# EasyEDA Pro project ProProject_运放实验_2024-09-24.epro, schematic Schematic_all
Create Date: 2023-09-07; Page Name: P1; Project Name: 运放实验; Schematic Name: Schematic_all; Update Date: 2023-09-07; Company: 嘉立创EDA; Page Size: A4; Version: V1.0
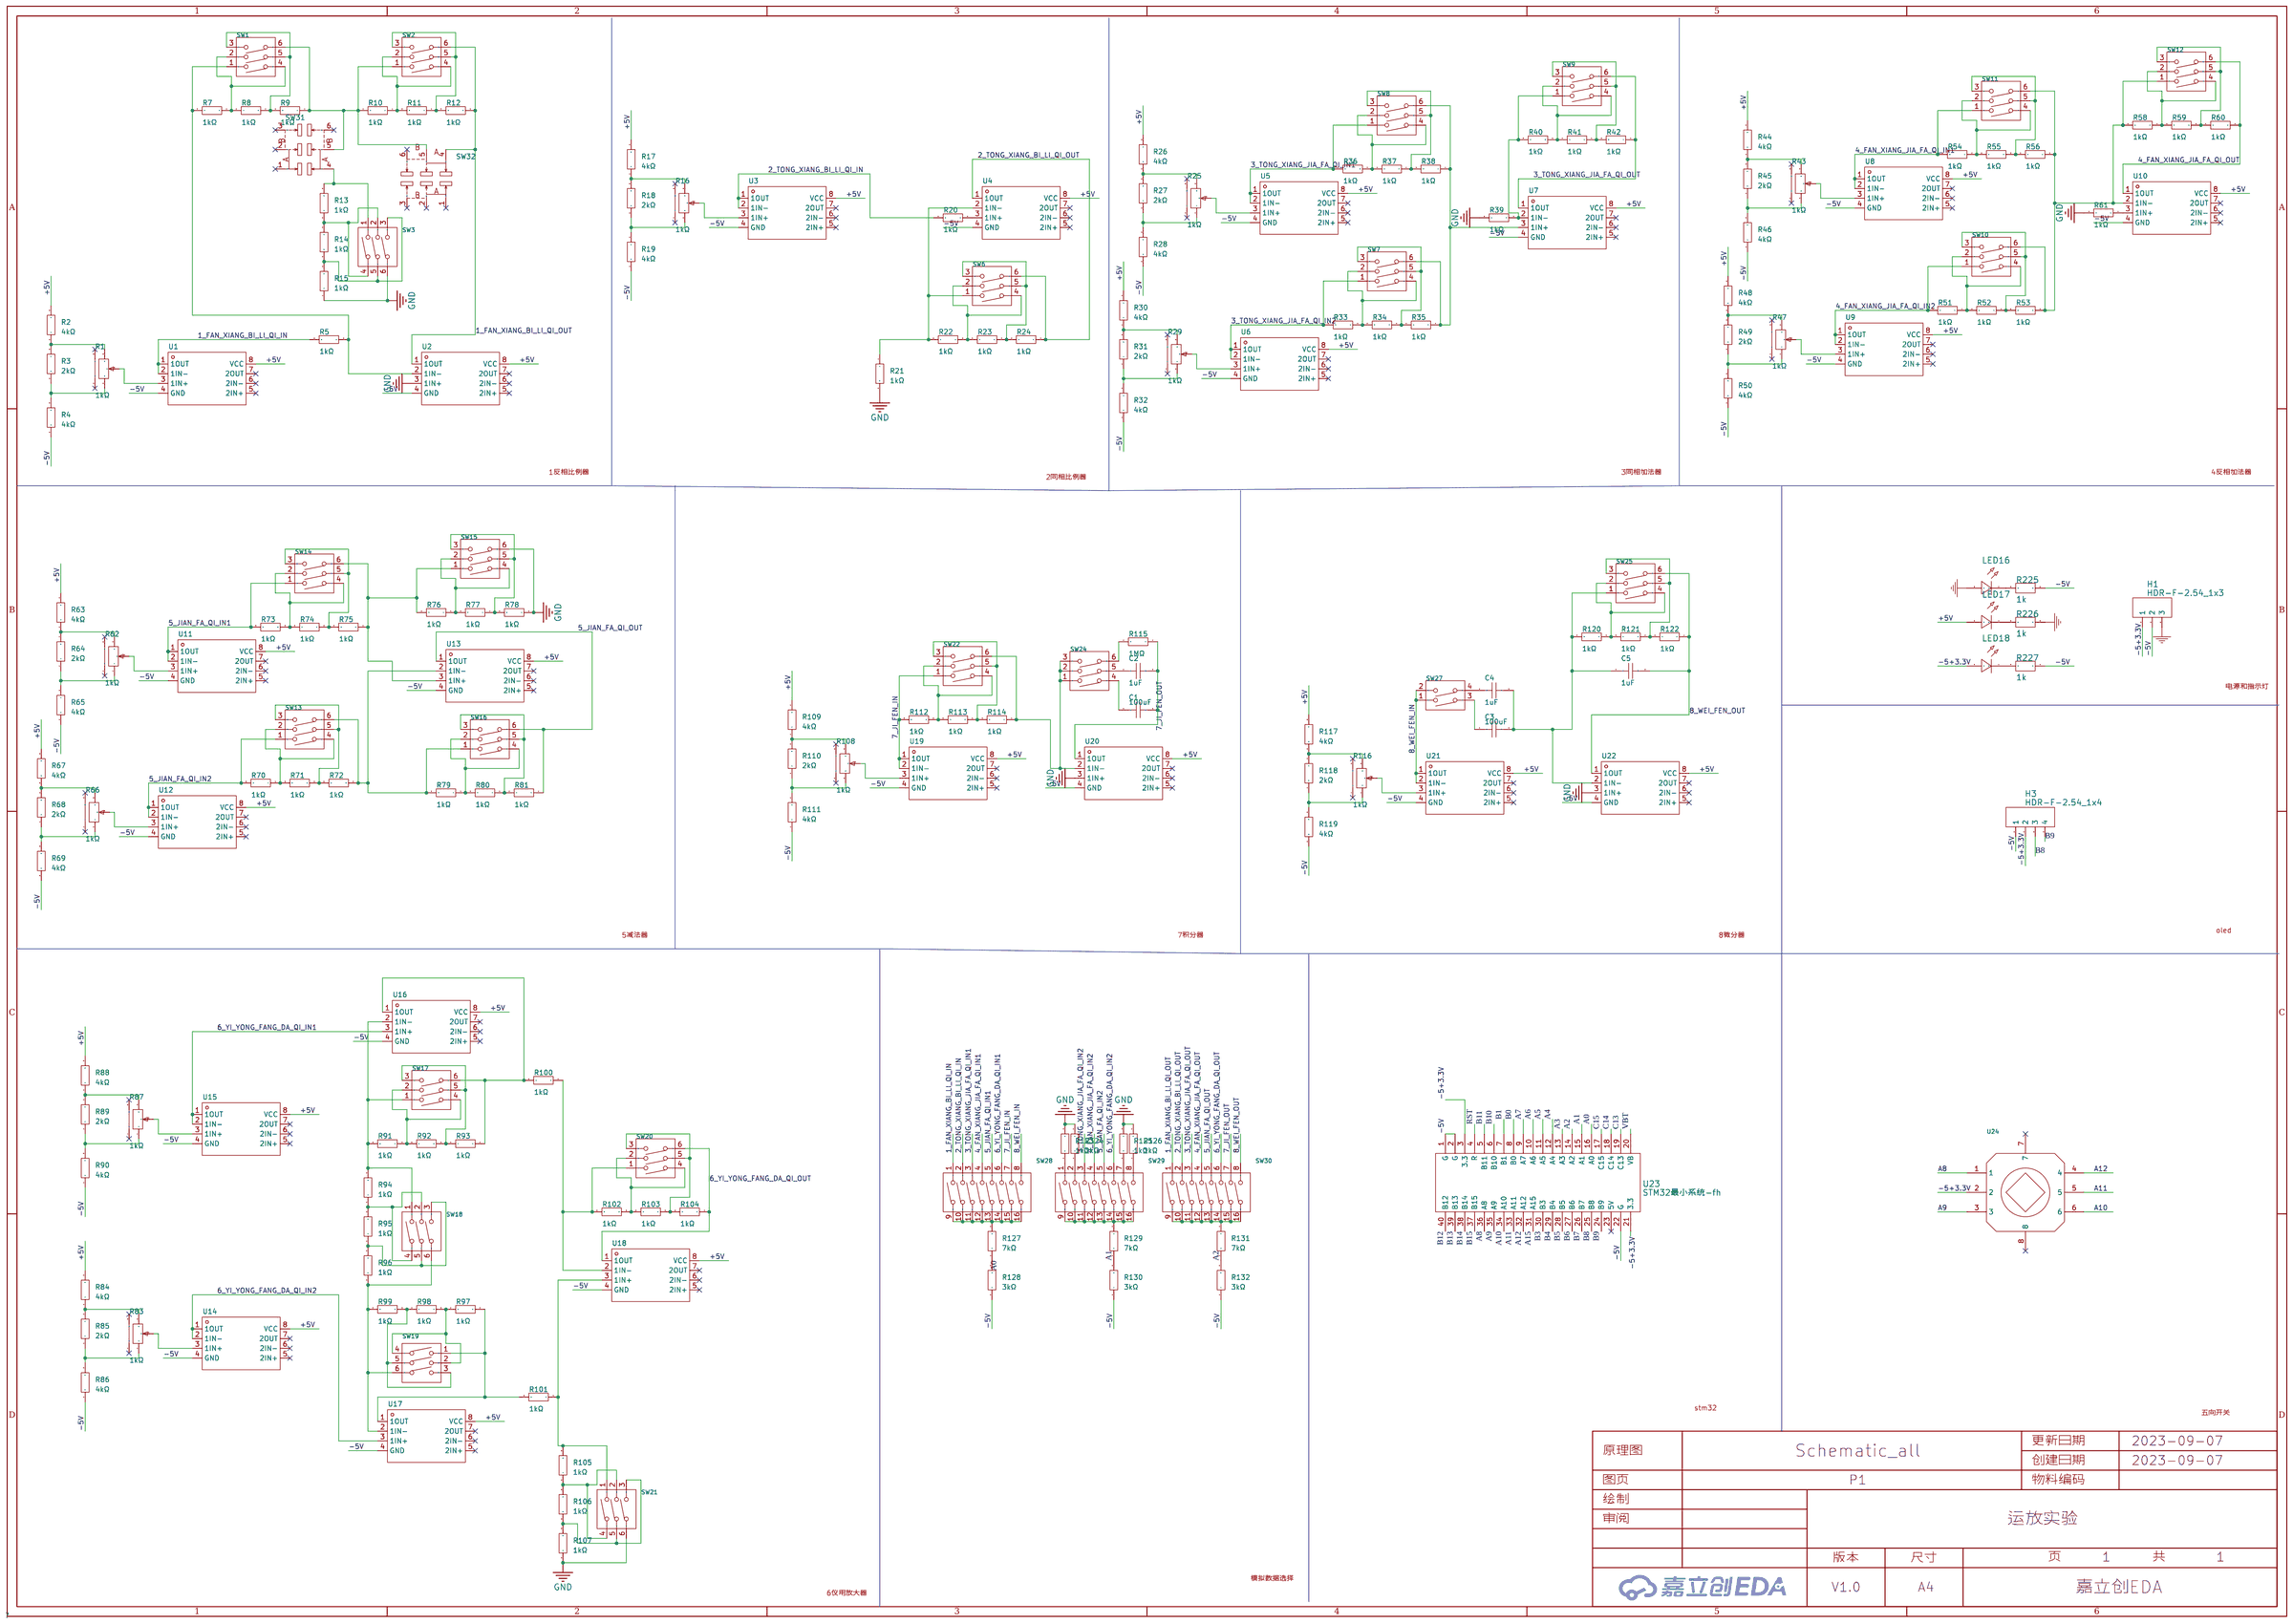
[diagram p4: schematic sheet]

## Parts
C1  100uF  [C0603]
C2  1uF  [C0603]
C3  100uF  [C0603]
C4  1uF  [C0603]
C5  1uF  [C0603]
H1  HDR-F-2.54_1x3  [HDR-F-2.54_1X3]
H3  HDR-F-2.54_1x4  [HDR-F-2.54_1X4]
LED16  -  [LED_0805]
LED17  -  [LED_0805]
LED18  -  [LED_0805]
R1  1kΩ  [RES-ADJ-TH_RK09K1130AJ3]
R2  4kΩ  [R0603]
R3  2kΩ  [R0603]
R4  4kΩ  [R0603]
R5  1kΩ  [R0603]
R7  1kΩ  [R0603]
R8  1kΩ  [R0603]
R9  1kΩ  [R0603]
R10  1kΩ  [R0603]
R11  1kΩ  [R0603]
R12  1kΩ  [R0603]
R13  1kΩ  [R0603]
R14  1kΩ  [R0603]
R15  1kΩ  [R0603]
R16  1kΩ  [RES-ADJ-TH_RK09K1130AJ3]
R17  4kΩ  [R0603]
R18  2kΩ  [R0603]
R19  4kΩ  [R0603]
R20  1kΩ  [R0603]
R21  1kΩ  [R0603]
R22  1kΩ  [R0603]
R23  1kΩ  [R0603]
R24  1kΩ  [R0603]
R25  1kΩ  [RES-ADJ-TH_RK09K1130AJ3]
R26  4kΩ  [R0603]
R27  2kΩ  [R0603]
R28  4kΩ  [R0603]
R29  1kΩ  [RES-ADJ-TH_RK09K1130AJ3]
R30  4kΩ  [R0603]
R31  2kΩ  [R0603]
R32  4kΩ  [R0603]
R33  1kΩ  [R0603]
R34  1kΩ  [R0603]
R35  1kΩ  [R0603]
R36  1kΩ  [R0603]
R37  1kΩ  [R0603]
R38  1kΩ  [R0603]
R39  1kΩ  [R0603]
R40  1kΩ  [R0603]
R41  1kΩ  [R0603]
R42  1kΩ  [R0603]
R43  1kΩ  [RES-ADJ-TH_RK09K1130AJ3]
R44  4kΩ  [R0603]
R45  2kΩ  [R0603]
R46  4kΩ  [R0603]
R47  1kΩ  [RES-ADJ-TH_RK09K1130AJ3]
R48  4kΩ  [R0603]
R49  2kΩ  [R0603]
R50  4kΩ  [R0603]
R51  1kΩ  [R0603]
R52  1kΩ  [R0603]
R53  1kΩ  [R0603]
R54  1kΩ  [R0603]
R55  1kΩ  [R0603]
R56  1kΩ  [R0603]
R58  1kΩ  [R0603]
R59  1kΩ  [R0603]
R60  1kΩ  [R0603]
R61  1kΩ  [R0603]
R62  1kΩ  [RES-ADJ-TH_RK09K1130AJ3]
R63  4kΩ  [R0603]
R64  2kΩ  [R0603]
R65  4kΩ  [R0603]
R66  1kΩ  [RES-ADJ-TH_RK09K1130AJ3]
R67  4kΩ  [R0603]
R68  2kΩ  [R0603]
R69  4kΩ  [R0603]
R70  1kΩ  [R0603]
R71  1kΩ  [R0603]
R72  1kΩ  [R0603]
R73  1kΩ  [R0603]
R74  1kΩ  [R0603]
R75  1kΩ  [R0603]
R76  1kΩ  [R0603]
R77  1kΩ  [R0603]
R78  1kΩ  [R0603]
R79  1kΩ  [R0603]
R80  1kΩ  [R0603]
R81  1kΩ  [R0603]
R83  1kΩ  [RES-ADJ-TH_RK09K1130AJ3]
R84  4kΩ  [R0603]
R85  2kΩ  [R0603]
R86  4kΩ  [R0603]
R87  1kΩ  [RES-ADJ-TH_RK09K1130AJ3]
R88  4kΩ  [R0603]
R89  2kΩ  [R0603]
R90  4kΩ  [R0603]
R91  1kΩ  [R0603]
R92  1kΩ  [R0603]
R93  1kΩ  [R0603]
R94  1kΩ  [R0603]
R95  1kΩ  [R0603]
R96  1kΩ  [R0603]
R97  1kΩ  [R0603]
R98  1kΩ  [R0603]
R99  1kΩ  [R0603]
R100  1kΩ  [R0603]
R101  1kΩ  [R0603]
R102  1kΩ  [R0603]
R103  1kΩ  [R0603]
R104  1kΩ  [R0603]
R105  1kΩ  [R0603]
R106  1kΩ  [R0603]
R107  1kΩ  [R0603]
R108  1kΩ  [RES-ADJ-TH_RK09K1130AJ3]
R109  4kΩ  [R0603]
R110  2kΩ  [R0603]
R111  4kΩ  [R0603]
R112  1kΩ  [R0603]
R113  1kΩ  [R0603]
R114  1kΩ  [R0603]
R115  1MΩ  [R0603]
R116  1kΩ  [RES-ADJ-TH_RK09K1130AJ3]
R117  4kΩ  [R0603]
R118  2kΩ  [R0603]
R119  4kΩ  [R0603]
R120  1kΩ  [R0603]
R121  1kΩ  [R0603]
R122  1kΩ  [R0603]
R123  1kΩ  [R0603]
R124  1kΩ  [R0603]
R125  1kΩ  [R0603]
R126  1kΩ  [R0603]
R127  7kΩ  [R0603]
R128  3kΩ  [R0603]
R129  7kΩ  [R0603]
R130  3kΩ  [R0603]
R131  7kΩ  [R0603]
R132  3kΩ  [R0603]
R225  1k  [R0805]
R226  1k  [R0805]
R227  1k  [R0805]
SW1  DSWB03LHGET  [SW-TH_DSWB03LHGET]
SW2  DSWB03LHGET  [SW-TH_DSWB03LHGET]
SW3  DSWB03LHGET  [SW-TH_DSWB03LHGET]
SW6  DSWB03LHGET  [SW-TH_DSWB03LHGET]
SW7  DSWB03LHGET  [SW-TH_DSWB03LHGET]
SW8  DSWB03LHGET  [SW-TH_DSWB03LHGET]
SW9  DSWB03LHGET  [SW-TH_DSWB03LHGET]
SW10  DSWB03LHGET  [SW-TH_DSWB03LHGET]
SW11  DSWB03LHGET  [SW-TH_DSWB03LHGET]
SW12  DSWB03LHGET  [SW-TH_DSWB03LHGET]
SW13  DSWB03LHGET  [SW-TH_DSWB03LHGET]
SW14  DSWB03LHGET  [SW-TH_DSWB03LHGET]
SW15  DSWB03LHGET  [SW-TH_DSWB03LHGET]
SW16  DSWB03LHGET  [SW-TH_DSWB03LHGET]
SW17  DSWB03LHGET  [SW-TH_DSWB03LHGET]
SW18  DSWB03LHGET  [SW-TH_DSWB03LHGET]
SW19  DSWB03LHGET  [SW-TH_DSWB03LHGET]
SW20  DSWB03LHGET  [SW-TH_DSWB03LHGET]
SW21  DSWB03LHGET  [SW-TH_DSWB03LHGET]
SW22  DSWB03LHGET  [SW-TH_DSWB03LHGET]
SW24  DSWB03LHGET  [SW-TH_DSWB03LHGET]
SW25  DSWB03LHGET  [SW-TH_DSWB03LHGET]
SW27  DSWB02LHGET  [SW-TH_DSWB02LHGET]
SW28  DSWB08LHGET  [SW-TH_DSWB08LHGET]
SW29  DSWB08LHGET  [SW-TH_DSWB08LHGET]
SW30  DSWB08LHGET  [SW-TH_DSWB08LHGET]
SW31  MST22D18G2  [SW-SMD_MST22D18G2]
SW32  MST22D18G2  [SW-SMD_MST22D18G2]
U1  LM393DR  [SOIC-8_L5.0-W4.0-P1.27-LS6.0-BL]
U2  LM393DR  [SOIC-8_L5.0-W4.0-P1.27-LS6.0-BL]
U3  LM393DR  [SOIC-8_L5.0-W4.0-P1.27-LS6.0-BL]
U4  LM393DR  [SOIC-8_L5.0-W4.0-P1.27-LS6.0-BL]
U5  LM393DR  [SOIC-8_L5.0-W4.0-P1.27-LS6.0-BL]
U6  LM393DR  [SOIC-8_L5.0-W4.0-P1.27-LS6.0-BL]
U7  LM393DR  [SOIC-8_L5.0-W4.0-P1.27-LS6.0-BL]
U8  LM393DR  [SOIC-8_L5.0-W4.0-P1.27-LS6.0-BL]
U9  LM393DR  [SOIC-8_L5.0-W4.0-P1.27-LS6.0-BL]
U10  LM393DR  [SOIC-8_L5.0-W4.0-P1.27-LS6.0-BL]
U11  LM393DR  [SOIC-8_L5.0-W4.0-P1.27-LS6.0-BL]
U12  LM393DR  [SOIC-8_L5.0-W4.0-P1.27-LS6.0-BL]
U13  LM393DR  [SOIC-8_L5.0-W4.0-P1.27-LS6.0-BL]
U14  LM393DR  [SOIC-8_L5.0-W4.0-P1.27-LS6.0-BL]
U15  LM393DR  [SOIC-8_L5.0-W4.0-P1.27-LS6.0-BL]
U16  LM393DR  [SOIC-8_L5.0-W4.0-P1.27-LS6.0-BL]
U17  LM393DR  [SOIC-8_L5.0-W4.0-P1.27-LS6.0-BL]
U18  LM393DR  [SOIC-8_L5.0-W4.0-P1.27-LS6.0-BL]
U19  LM393DR  [SOIC-8_L5.0-W4.0-P1.27-LS6.0-BL]
U20  LM393DR  [SOIC-8_L5.0-W4.0-P1.27-LS6.0-BL]
U21  LM393DR  [SOIC-8_L5.0-W4.0-P1.27-LS6.0-BL]
U22  LM393DR  [SOIC-8_L5.0-W4.0-P1.27-LS6.0-BL]
U23  STM32最小系统-fh  [STM32最小系统板]
U24  GT-TCA06F-H050-L1  [KEY-SMD_GT-TCA06F-H050-L1]

## Library data of the parts
C1-C5 = CAP_0603: Supplier Footprint: 0603
H1 = HDR-F-2.54_1x3: Supplier Part: C146690; Supplier: LCSC
H3 = HDR-F-2.54_1x4: Supplier Part: C225501; Supplier: LCSC
LED16-LED18 = LED_0805-R: Supplier Footprint: 0805
R1 R16 R25 R29 R43 R47 R62 R66 R83 R87 R108 R116 = RK09K1130AJ3: 阻值:10kΩ;精度:±20%;功率:50mW;; LCSC Part Name: 10kΩ ±20%; Supplier Part: C388854; Manufacturer: ALPSALPINE(阿尔卑斯阿尔派); Supplier Footprint: 插件; JLCPCB Part Class: 扩展库; Datasheet: https://atta.szlcsc.com/upload/public/pdf/source/20190429/C388854_7CB4260EB45E5FBD5A81223BC5101220.pdf; Supplier: LCSC; Tolerance: ±20%; Power(Watts): 50mW; Rated Voltage: 20V
R2-R5 R7-R15 R17-R24 R26-R28 R30-R42 R44-R46 R48-R56 R58-R61 R63-R65 R67-R81 R84-R86 R88-R107 R109-R115 R117-R132 = 0603WAF1002T5E: 电阻类型:厚膜电阻;阻值:10kΩ;精度:±1%;功率:100mW;; LCSC Part Name: 厚膜电阻 10kΩ ±1% 100mW; Supplier Part: C25804; Manufacturer: UNI-ROYAL(厚声); Supplier Footprint: 0603; JLCPCB Part Class: 基础库; Datasheet: https://atta.szlcsc.com/upload/public/pdf/source/20200306/C422600_1E6D84923E4A46A82E41ADD87F860B5C.pdf; Supplier: LCSC; Type: 厚膜电阻; Tolerance: ±1%; Power(Watts): 100mW; Temperature Coefficient: ±100ppm/℃; Overload Voltage (Max): 75V; Operating Temperature Range: -55℃~+155℃
R225-R227 = 1k
SW1-SW3 SW6-SW22 SW24 SW25 = DSWB03LHGET: 类型:平拨,凸起式;电路结构:单刀单掷;开关位数:3;使用寿命:-;颜色:红色;; LCSC Part Name: 间距1.27mm 平拨,凸起式 3位拨码开关; Supplier Part: C99420; Manufacturer: YE; Supplier Footprint: 插件; JLCPCB Part Class: 扩展库; Datasheet: https://atta.szlcsc.com/upload/public/pdf/source/20170330/1490854274194.pdf; Supplier: LCSC; Type: 平拨,凸起式; Circuit: 单刀单掷; Number of Positions: 3; Lead Pitch: 2.54mm; Color: 红色
SW27 = DSWB02LHGET: 类型:平拨,凸起式;电路结构:单刀单掷;开关位数:2;使用寿命:-;颜色:红色;; LCSC Part Name: 拨码开关,平拨开关,DSWB02LHGET; Supplier Part: C99421; Manufacturer: YE; Supplier Footprint: 插件; JLCPCB Part Class: 扩展库; Datasheet: https://atta.szlcsc.com/upload/public/pdf/source/20170330/1490854270511.pdf; Supplier: LCSC; Type: 平拨,凸起式; Circuit: 单刀单掷; Number of Positions: 2; Lead Pitch: 2.54mm; Color: 红色
SW28-SW30 = DSWB08LHGET: 类型:平拨,凸起式;电路结构:单刀单掷;开关位数:8;使用寿命:-;颜色:红色;; LCSC Part Name: 间距2.54mm 平拨,凸起式  8位拨码开关; Supplier Part: C99413; Manufacturer: YE; Supplier Footprint: 插件; JLCPCB Part Class: 扩展库; Datasheet: https://atta.szlcsc.com/upload/public/pdf/source/20170330/1490854214069.pdf; Supplier: LCSC; Type: 平拨,凸起式; Circuit: 单刀单掷; Number of Positions: 8; Lead Pitch: 2.54mm; Color: 红色
SW31 SW32 = MST22D18G2: 额定电流(DC)：50mA 额定电压(DC)：12V 电路结构：单刀双掷 安装方式：立贴 机械寿命：10000 滑钮形状：矩形柱状 引脚样式：SMD接片 工作温度：-30℃~+80℃ 开关长度：9.1mm 开关宽度：3.6mm 开关高度：3.45mm 柄高：2mm; LCSC Part Name: 两档立式贴片 6脚拨动 柄长2.0MM; Supplier Part: C431544; Manufacturer: SHOU HAN(首韩); Supplier Footprint: SMD,3.6x9.1mm; JLCPCB Part Class: 扩展库; Datasheet: https://atta.szlcsc.com/upload/public/pdf/source/20190925/C431544_D32DFFD935A96A6C5145903882D4ABA1.pdf; Supplier: LCSC
U1-U22 = LM393DR: 比较器组数:2;电源电压:2V~36V,±1V~18V;各通道供电电流:2.5mA;输出类型:CMOS, MOS, Open-Collector, TTL;传播延迟:-;; Supplier Part: C67470; Manufacturer: TI(德州仪器); Supplier Footprint: SOIC-8-150mil; JLCPCB Part Class: 扩展库; Datasheet: https://atta.szlcsc.com/upload/public/pdf/source/20160127/1457707757853.pdf; Supplier: LCSC; Number of Elements: 2; Supply Voltage（Single）: 2V~36V,±1V~18V; Iq per channel (Typ): 2.5mA; Output Type: CMOS, MOS, Open-Collector, TTL; Operating Temperature: 0°C ~ 70°C
U23 = STM32最小系统-fh
U24 = GT-TCA06F-H050-L1: 机械寿命:-;; LCSC Part Name: 斜五向轻触开关 H5.0mm 400gf 带贴片脚; Supplier Part: C3019725; Manufacturer: G-Switch(品赞); Supplier Footprint: SMD; JLCPCB Part Class: Extended Part; Datasheet: https://atta.szlcsc.com/upload/public/pdf/source/20220627/F7A64F0F346B15FF80DEC5591ADA8118.pdf; Supplier: LCSC; Switch Length: 7.5mm; Switch Width: 7.5mm; Switch Height: 5mm

## Nets
+5V: LED17.2(A) R2.2 R17.2 R26.2 R30.2 R44.2 R48.2 R63.2 R67.2 R84.2 R88.2 R109.2 R117.2 U1.8(VCC) U2.8(VCC) U3.8(VCC) U4.8(VCC) U5.8(VCC) U6.8(VCC) U7.8(VCC) U8.8(VCC) U9.8(VCC) U10.8(VCC) U11.8(VCC) U12.8(VCC) U13.8(VCC) U14.8(VCC) U15.8(VCC) U16.8(VCC) U17.8(VCC) U18.8(VCC) U19.8(VCC) U20.8(VCC) U21.8(VCC) U22.8(VCC)
-5V: H1.2 H3.1 R4.1 R19.1 R28.1 R32.1 R46.1 R50.1 R65.1 R69.1 R86.1 R90.1 R111.1 R119.1 R128.1 R130.1 R132.1 R225.1 R227.1 U1.4(GND) U2.4(GND) U3.4(GND) U4.4(GND) U5.4(GND) U6.4(GND) U7.4(GND) U8.4(GND) U9.4(GND) U10.4(GND) U11.4(GND) U12.4(GND) U13.4(GND) U14.4(GND) U15.4(GND) U16.4(GND) U17.4(GND) U18.4(GND) U19.4(GND) U20.4(GND) U21.4(GND) U22.4(GND) U23.1(G) U23.2(G) U23.22(G)
GND: H1.3 LED16.2(A) R15.1 R21.2 R39.2 R61.2 R78.1 R107.1 R123.2 R124.2 R125.2 R126.2 R226.1 SW3.6 SW15.6 SW21.6 U2.3(1IN+) U20.3(1IN+) U22.3(1IN+)
1_FAN_XIANG_BI_LI_QI_IN: R5.2 SW28.1 U1.1(1OUT) U1.2(1IN-)
1_FAN_XIANG_BI_LI_QI_OUT: R12.1 SW2.6 SW30.1 SW32.4 U2.1(1OUT)
2_TONG_XIANG_BI_LI_QI_IN: R20.2 SW28.2 U3.1(1OUT) U3.2(1IN-)
2_TONG_XIANG_BI_LI_QI_OUT: R24.1 SW6.6 SW30.2 U4.1(1OUT)
3_TONG_XIANG_JIA_FA_QI_IN1: R36.2 SW8.1 SW28.3 U5.1(1OUT) U5.2(1IN-)
3_TONG_XIANG_JIA_FA_QI_IN2: R33.2 SW7.1 SW29.3 U6.1(1OUT) U6.2(1IN-)
3_TONG_XIANG_JIA_FA_QI_OUT: R42.1 SW9.6 SW30.3 U7.1(1OUT)
4_FAN_XIANG_JIA_FA_QI_IN1: R54.2 SW11.1 SW28.4 U8.1(1OUT) U8.2(1IN-)
4_FAN_XIANG_JIA_FA_QI_IN2: R51.2 SW10.1 SW29.4 U9.1(1OUT) U9.2(1IN-)
4_FAN_XIANG_JIA_FA_QI_OUT: R60.1 SW12.6 SW30.4 U10.1(1OUT)
5_JIAN_FA_QI_IN1: R73.2 SW14.1 SW28.5 U11.1(1OUT) U11.2(1IN-)
5_JIAN_FA_QI_IN2: R70.2 SW13.1 SW29.5 U12.1(1OUT) U12.2(1IN-)
5_JIAN_FA_QI_OUT: R81.1 SW16.6 SW30.5 U13.1(1OUT)
6_YI_YONG_FANG_DA_QI_IN1: SW28.6 U15.1(1OUT) U15.2(1IN-) U16.3(1IN+)
6_YI_YONG_FANG_DA_QI_IN2: SW29.6 U14.1(1OUT) U14.2(1IN-) U17.3(1IN+)
6_YI_YONG_FANG_DA_QI_OUT: R104.1 SW20.6 SW30.6 U18.1(1OUT)
7_JI_FEN_IN: R112.2 SW22.1 SW28.7 U19.1(1OUT) U19.2(1IN-)
7_JI_FEN_OUT: C1.2 C2.2 R115.1 SW30.7 U20.1(1OUT)
8_WEI_FEN_IN: SW27.1 SW27.2 SW28.8 U21.1(1OUT) U21.2(1IN-)
8_WEI_FEN_OUT: C5.2 R122.1 SW25.6 SW30.8 U22.1(1OUT)
-5+3.3V: H1.1 H3.2 LED18.2(A) U23.3(3.3) U23.21(3.3) U24.2
A0: R127.1 R128.2 U23.16(A0)
A1: R129.1 R130.2 U23.15(A1)
A2: R131.1 R132.2 U23.14(A2)
A3: U23.13(A3)
A4: U23.12(A4)
A5: U23.11(A5)
A6: U23.10(A6)
A7: U23.9(A7)
A8: U23.36(A8) U24.1
A9: U23.35(A9) U24.3
A10: U23.34(A10) U24.6
A11: U23.33(A11) U24.5
A12: U23.32(A12) U24.4
A15: U23.31(A15)
B0: U23.8(B0)
B1: U23.7(B1)
B3: U23.30(B3)
B4: U23.29(B4)
B5: U23.28(B5)
B6: U23.27(B6)
B7: U23.26(B7)
B8: H3.3 U23.25(B8)
B9: H3.4 U23.24(B9)
B10: U23.6(B10)
B11: U23.5(B11)
B12: U23.40(B12)
B13: U23.39(B13)
B14: U23.38(B14)
B15: U23.37(B15)
C13: U23.19(C13)
C14: U23.18(C14)
C15: U23.17(C15)
RST: U23.4(R)
VBT: U23.20(VB)
$1N5564: R62.3 R63.1 R64.2
$1N5567: R62.1 R64.1 R65.2
$1N5578: R62.2 U11.3(1IN+)
$1N5588: R66.3 R67.1 R68.2
$1N5591: R66.1 R68.1 R69.2
$1N5602: R66.2 U12.3(1IN+)
$1N5609: R70.1 R71.2 SW13.2 SW13.4
$1N5617: R71.1 R72.2 SW13.3 SW13.5
$1N5625: R73.1 R74.2 SW14.2 SW14.4
$1N5633: R74.1 R75.2 SW14.3 SW14.5
$1N5932: R76.1 R77.2 SW15.2 SW15.4
$1N5940: R77.1 R78.2 SW15.3 SW15.5
$1N5959: R75.1 R76.2 SW14.6 SW15.1 U13.3(1IN+)
$1N6163: R79.1 R80.2 SW16.2 SW16.4
$1N6171: R80.1 R81.2 SW16.3 SW16.5
$1N6191: R72.1 R79.2 SW13.6 SW16.1 U13.2(1IN-)
$1N6501: R83.3 R84.1 R85.2
$1N6504: R83.1 R85.1 R86.2
$1N6515: R83.2 U14.3(1IN+)
$1N6753: R87.3 R88.1 R89.2
$1N6756: R87.1 R89.1 R90.2
$1N6767: R87.2 U15.3(1IN+)
$1N7112: R91.1 R92.2 SW17.2 SW17.4
$1N7120: R92.1 R93.2 SW17.3 SW17.5
$1N7297: R94.1 R95.2 SW18.2 SW18.4
$1N7305: R95.1 R96.2 SW18.3 SW18.5
$1N7478: R97.1 R98.2 SW19.2 SW19.4
$1N7486: R98.1 R99.2 SW19.3 SW19.5
$1N7519: R91.2 R94.2 SW17.1 SW18.1 U16.2(1IN-)
$1N7528: R93.1 R100.2 SW17.6 U16.1(1OUT)
$1N7610: R96.1 R99.1 SW18.6 SW19.6 U17.2(1IN-)
$1N7723: R97.2 R101.2 SW19.1 U17.1(1OUT)
$1N7950: R102.1 R103.2 SW20.2 SW20.4
$1N7958: R103.1 R104.2 SW20.3 SW20.5
$1N8133: R105.1 R106.2 SW21.2 SW21.4
$1N8141: R106.1 R107.2 SW21.3 SW21.5
$1N8558: R101.1 R105.2 SW21.1 U18.3(1IN+)
$1N8570: R100.1 R102.2 SW20.1 U18.2(1IN-)
$1N8808: R108.3 R109.1 R110.2
$1N8811: R108.1 R110.1 R111.2
$1N8822: R108.2 U19.3(1IN+)
$1N9066: R112.1 R113.2 SW22.2 SW22.4
$1N9074: R113.1 R114.2 SW22.3 SW22.5
$1N9289: C1.1 SW24.4
$1N9422: C2.1 SW24.5
$1N9426: R114.1 SW22.6 SW24.1 SW24.2 SW24.3 U20.2(1IN-)
$1N9437: R115.2 SW24.6
$1N10669: R116.3 R117.1 R118.2
$1N10672: R116.1 R118.1 R119.2
$1N10683: R116.2 U21.3(1IN+)
$1N10903: R120.1 R121.2 SW25.2 SW25.4
$1N10911: R121.1 R122.2 SW25.3 SW25.5
$1N11058: C3.1 SW27.3
$1N11164: C4.1 SW27.4
$1N11228: C3.2 C4.2 C5.1 R120.2 SW25.1 U22.2(1IN-)
$1N11683: R123.1 SW29.1
$1N11722: R124.1 SW29.2
$1N11761: R125.1 SW29.7
$1N11800: R126.1 SW29.8
$1N16821: R127.2 SW28.9 SW28.10 SW28.11 SW28.12 SW28.13 SW28.14 SW28.15 SW28.16
$1N16840: R129.2 SW29.9 SW29.10 SW29.11 SW29.12 SW29.13 SW29.14 SW29.15 SW29.16
$1N16862: R131.2 SW30.9 SW30.10 SW30.11 SW30.12 SW30.13 SW30.14 SW30.15 SW30.16
$1N26687: LED16.1(C) R225.2
$1N26764: LED17.1(C) R226.2
$1N26843: LED18.1(C) R227.2
Net-(R1-1): R1.1 R3.1 R4.2
Net-(R1-2): R1.2 U1.3(1IN+)
Net-(R1-3): R1.3 R2.1 R3.2
Net-(R5-1): R5.1 R7.2 SW1.1 U2.2(1IN-)
Net-(R7-1): R7.1 R8.2 SW1.2 SW1.4
Net-(R8-1): R8.1 R9.2 SW1.3 SW1.5
Net-(R9-1): R9.1 R10.2 SW1.6 SW2.1 SW31.5 SW32.5
Net-(R10-1): R10.1 R11.2 SW2.2 SW2.4
Net-(R11-1): R11.1 R12.2 SW2.3 SW2.5
Net-(R13-1): R13.1 R14.2 SW3.2 SW3.4
Net-(R13-2): R13.2 SW3.1 SW31.4
Net-(R14-1): R14.1 R15.2 SW3.3 SW3.5
Net-(R16-1): R16.1 R18.1 R19.2
Net-(R16-2): R16.2 U3.3(1IN+)
Net-(R16-3): R16.3 R17.1 R18.2
Net-(R20-1): R20.1 U4.3(1IN+)
Net-(R21-1): R21.1 R22.2 SW6.1 U4.2(1IN-)
Net-(R22-1): R22.1 R23.2 SW6.2 SW6.4
Net-(R23-1): R23.1 R24.2 SW6.3 SW6.5
Net-(R25-1): R25.1 R27.1 R28.2
Net-(R25-2): R25.2 U5.3(1IN+)
Net-(R25-3): R25.3 R26.1 R27.2
Net-(R29-1): R29.1 R31.1 R32.2
Net-(R29-2): R29.2 U6.3(1IN+)
Net-(R29-3): R29.3 R30.1 R31.2
Net-(R33-1): R33.1 R34.2 SW7.2 SW7.4
Net-(R34-1): R34.1 R35.2 SW7.3 SW7.5
Net-(R35-1): R35.1 R38.1 SW7.6 SW8.6 U7.3(1IN+)
Net-(R36-1): R36.1 R37.2 SW8.2 SW8.4
Net-(R37-1): R37.1 R38.2 SW8.3 SW8.5
Net-(R39-1): R39.1 R40.2 SW9.1 U7.2(1IN-)
Net-(R40-1): R40.1 R41.2 SW9.2 SW9.4
Net-(R41-1): R41.1 R42.2 SW9.3 SW9.5
Net-(R43-1): R43.1 R45.1 R46.2
Net-(R43-2): R43.2 U8.3(1IN+)
Net-(R43-3): R43.3 R44.1 R45.2
Net-(R47-1): R47.1 R49.1 R50.2
Net-(R47-2): R47.2 U9.3(1IN+)
Net-(R47-3): R47.3 R48.1 R49.2
Net-(R51-1): R51.1 R52.2 SW10.2 SW10.4
Net-(R52-1): R52.1 R53.2 SW10.3 SW10.5
Net-(R53-1): R53.1 R56.1 R58.2 SW10.6 SW11.6 SW12.1 U10.2(1IN-)
Net-(R54-1): R54.1 R55.2 SW11.2 SW11.4
Net-(R55-1): R55.1 R56.2 SW11.3 SW11.5
Net-(R58-1): R58.1 R59.2 SW12.2 SW12.4
Net-(R59-1): R59.1 R60.2 SW12.3 SW12.5
Net-(R61-1): R61.1 U10.3(1IN+)

Not connected (* = marked no-connect by the designer): R1 4* 5*; R16 4* 5*; R25 4* 5*; R29 4* 5*; R43 4* 5*; R47 4* 5*; R62 4* 5*; R66 4* 5*; R83 4* 5*; R87 4* 5*; R108 4* 5*; R116 4* 5*; SW31 1* 2* 3* 6*; SW32 1* 2* 3* 6*; U1 5(2IN+)* 6(2IN-)* 7(2OUT)*; U2 5(2IN+)* 6(2IN-)* 7(2OUT)*; U3 5(2IN+)* 6(2IN-)* 7(2OUT)*; U4 5(2IN+)* 6(2IN-)* 7(2OUT)*; U5 5(2IN+)* 6(2IN-)* 7(2OUT)*; U6 5(2IN+)* 6(2IN-)* 7(2OUT)*; U7 5(2IN+)* 6(2IN-)* 7(2OUT)*; U8 5(2IN+)* 6(2IN-)* 7(2OUT)*; U9 5(2IN+)* 6(2IN-)* 7(2OUT)*; U10 5(2IN+)* 6(2IN-)* 7(2OUT)*; U11 5(2IN+)* 6(2IN-)* 7(2OUT)*; U12 5(2IN+)* 6(2IN-)* 7(2OUT)*; U13 5(2IN+)* 6(2IN-)* 7(2OUT)*; U14 5(2IN+)* 6(2IN-)* 7(2OUT)*; U15 5(2IN+)* 6(2IN-)* 7(2OUT)*; U16 5(2IN+)* 6(2IN-)* 7(2OUT)*; U17 5(2IN+)* 6(2IN-)* 7(2OUT)*; U18 5(2IN+)* 6(2IN-)* 7(2OUT)*; U19 5(2IN+)* 6(2IN-)* 7(2OUT)*; U20 5(2IN+)* 6(2IN-)* 7(2OUT)*; U21 5(2IN+)* 6(2IN-)* 7(2OUT)*; U22 5(2IN+)* 6(2IN-)* 7(2OUT)*; U23 23(5V)*; U24 7* 8*

## Notes on the sheet
- 1反相比例器
- 2同相比例器
- 3同相加法器
- 4反相加法器
- 电源和指示灯
- 5减法器
- 7积分器
- 8微分器
- oled
- stm32
- 五向开关
- 模拟数据选择
- 6仪用放大器
